# EAGLE design MinimusADC (EAGLE 6.2)
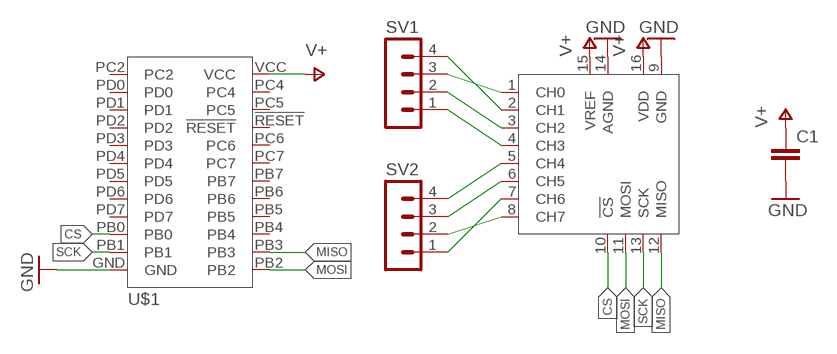
[diagram p0: schematic, sheet 1]

## Parts
C1  C-EUC0805  [C0805]
SV1  MA04-1  [MA04-1]
SV2  MA04-1  [MA04-1]
U$1  MINIMUSNODIM  [MINIMUSNOPINS]
U$2  MCP3008SL  [SO16]

## Nets
CH0: SV1.3 U$2.1(CH0)
CH1: SV1.4 U$2.2(CH1)
CH2: SV1.2 U$2.3(CH2)
CH3: SV1.1 U$2.4(CH3)
CH4: SV2.4 U$2.5(CH4)
CH5: SV2.3 U$2.6(CH5)
CH6: SV2.1 U$2.7(CH6)
CH7: SV2.2 U$2.8(CH7)
CS: U$1.PB0 U$2.10(!CS)
GND: C1.2 U$1.GND U$2.9(GND) U$2.14(AGND)
MISO: U$1.PB3 U$2.12(MISO)
MOSI: U$1.PB2 U$2.11(MOSI)
SCK: U$1.PB1 U$2.13(SCK)
V+: C1.1 U$1.VCC U$2.15(VREF) U$2.16(VDD)
Unconnected: U$1.!RESET U$1.PB4 U$1.PB5 U$1.PB6 U$1.PB7 U$1.PC2 U$1.PC4 U$1.PC5 U$1.PC6 U$1.PC7 U$1.PD0 U$1.PD1 U$1.PD2 U$1.PD3 U$1.PD4 U$1.PD5 U$1.PD6 U$1.PD7

## Library data of the parts
C1 = rcl:C-EU: CAPACITOR, European symbol
SV1 SV2 = con-lstb:MA04-1: PIN HEADER; OC_FARNELL: unknown; OC_NEWARK: unknown
U$1 = minimus:MINIMUS
U$2 = MCP3008:MCP3008

## Board
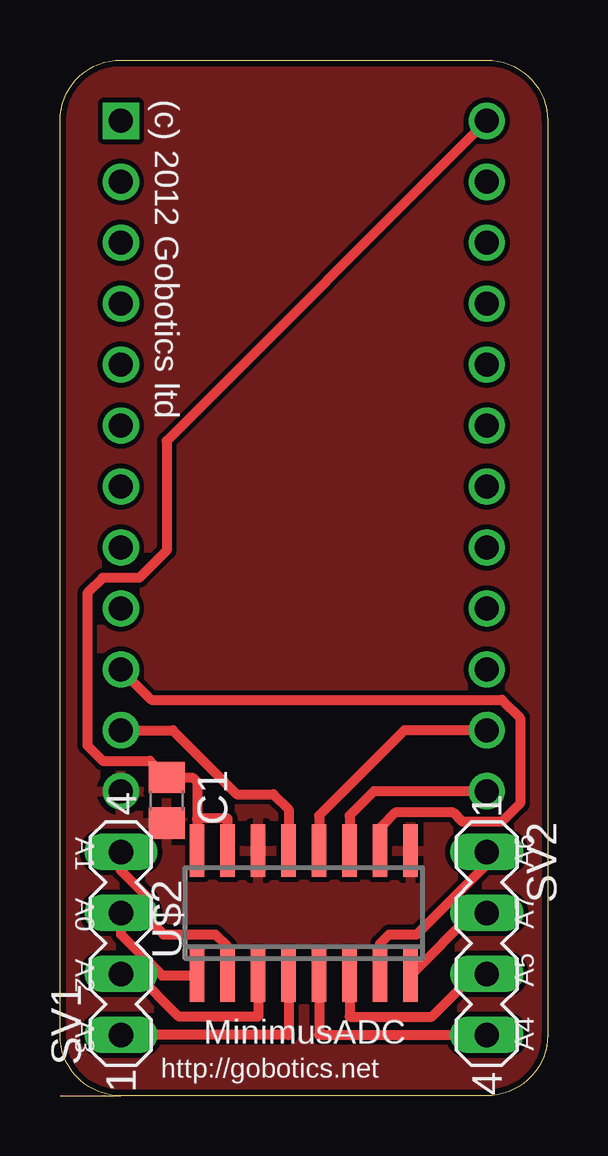
[diagram p1: board, top side]

Size 20.32 x 43.18 mm. Coordinates in mm from the lower left corner, seen from the top.
Outline: 0,0 2.54,0
Outline: 2.54,0 17.78,0 arc90 20.32,2.54 20.32,40.64 arc90 17.78,43.18 2.54,43.18 arc90 0,40.64 0,2.54 arc90 2.54,0
Copper layers (1*16): Top 0.035mm / dielectric 1.5mm / Bottom 0.035mm
Design rules: minimum track width 6mil, minimum drill 12mil, track to track 6mil, track to pad 6mil, pad to pad 6mil, via to via 6mil, smd to smd 0mil, copper to edge 10mil, drill to drill 10mil, minimum pad ring 10mil, minimum via ring 6mil, stop-mask expansion 2mil, vias tented up to drill 100mil, thermal gap 10mil

### Footprints (pad centres in the part's own frame; a part is rotated, then mirrored left to right if it is on the bottom)
C0805 = smd 1.3 x 1.5: 1 -0.95,0; 2 0.95,0
MA04-1 = drill 1.016 long: 1 -3.81,0; 2 -1.27,0; 3 1.27,0; 4 3.81,0
MINIMUSNOPINS = drill 1: !RESET 15.24,-7.62; GND 0,-27.94; PB0 0,-22.86; PB1 0,-25.4; PB2 15.24,-27.94; PB3 15.24,-25.4; PB4 15.24,-22.86; PB5 15.24,-20.32; PB6 15.24,-17.78; PB7 15.24,-15.24; PC4 15.24,-2.54; PC5 15.24,-5.08; PC6 15.24,-10.16; PC7 15.24,-12.7; PD0 0,-2.54; PD1 0,-5.08; PD2 0,-7.62; PD3 0,-10.16; PD4 0,-12.7; PD5 0,-15.24; PD6 0,-17.78; PD7 0,-20.32; VCC 15.24,0 | drill 1 square: PC2 0,0
SO16 = smd 0.6 x 2.2: 1 -4.445,-2.6; 2 -3.175,-2.6; 3 -1.905,-2.6; 4 -0.635,-2.6; 5 0.635,-2.6; 6 1.905,-2.6; 7 3.175,-2.6; 8 4.445,-2.6; 9 4.445,2.6; 10 3.175,2.6; 11 1.905,2.6; 12 0.635,2.6; 13 -0.635,2.6; 14 -1.905,2.6; 15 -3.175,2.6; 16 -4.445,2.6

### Placement (x,y rotation side)
C1  4.45,12.32 270 top
SV1  2.54,6.35 90 top
SV2  17.78,6.35 270 top
U$1  2.54,40.64 0 top
U$2  10.16,7.62 0 top

### Tracks (layer width: path | path; a pad name or v marks a point on that pad's centre or on a via)
CH0
  Top 0.406: SV1.3 2.54,6.73 4.25,5.02 U$2.1
CH1
  Top 0.406: U$2.2 6.99,6.22 6.48,6.73 4.32,6.73 3.68,7.37 3.68,8.26 2.54,9.4 SV1.4
CH2
  Top 0.406: U$2.3 8.26,3.3 4.95,3.3 3.17,5.08 SV1.2
CH3
  Top 0.406: U$2.4 9.53,2.54 SV1.1
CH4
  Top 0.406: U$2.5 10.79,2.54 SV2.4
CH5
  Top 0.406: U$2.6 12.06,3.3 15.49,3.3 17.27,5.08 SV2.3
CH6
  Top 0.406: U$2.7 13.34,6.35 13.72,6.73 14.86,6.73 17.78,9.65 SV2.1
CH7
  Top 0.406: U$2.8 17.2,7.62 SV2.2
CS
  Top 0.406: U$2.10 13.34,11.18 13.97,11.81 16.38,11.81 16.76,11.43 18.41,11.43 19.18,12.19 19.18,15.75 18.41,16.51 3.81,16.51 U$1.PB0
GND
  pour Top (isolate 0.203): -1.27,45.72 21.59,45.72 21.59,0 -1.27,0
MISO
  Top 0.406: U$1.PB3 14.35,15.24 10.79,11.68 U$2.12
MOSI
  Top 0.406: U$1.PB2 13.08,12.7 12.06,11.68 U$2.11
SCK
  Top 0.406: U$2.13 9.53,11.94 8.89,12.57 7.37,12.57 4.7,15.24 U$1.PB1
V+
  Top 0.406: U$1.VCC 4.45,27.3 4.45,22.73 3.3,21.59 1.78,21.59 1.14,20.95 1.14,14.61 1.78,13.97 3.74,13.97 C1.1 5.53,13.27 5.71,13.08 5.71,11.56 | 5.71,11.56 U$2.16 | U$2.15 6.99,11.56 5.71,11.56

### Text on the board
_tsilk: (c) 2012 Gobotics ltd | A1 | A6 | A0 | A7 | A2 | A5 | A3 | A4 | MinimusADC | http://gobotics.net